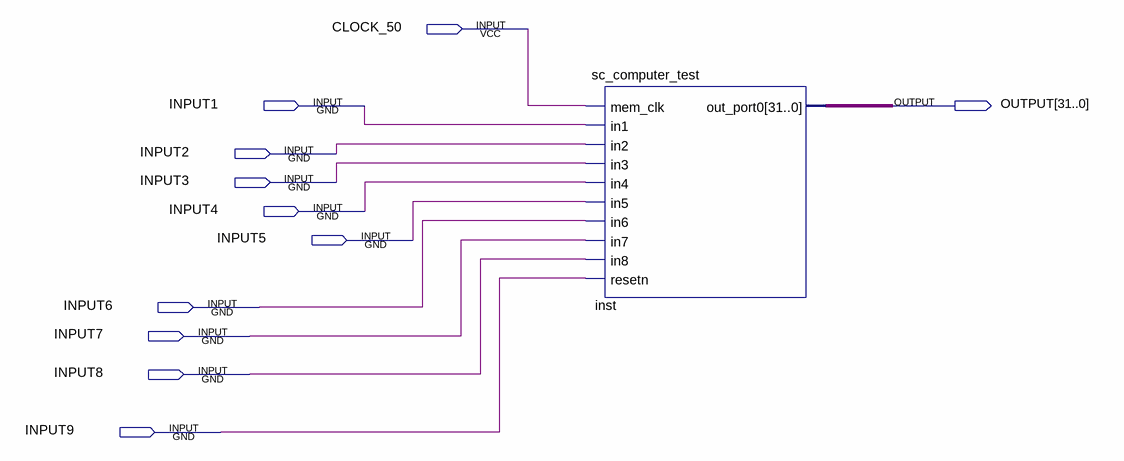
[diagram p0: schematic sheet]
// Quartus schematic sc_computer_version.bdf as structural Verilog: 1 symbols, 11 pins
module sc_computer_version (
  input  CLOCK_50,
  input  INPUT1,
  input  INPUT2,
  input  INPUT3,
  input  INPUT4,
  input  INPUT5,
  input  INPUT6,
  input  INPUT7,
  input  INPUT8,
  input  INPUT9,
  output [31:0] OUTPUT
);

  sc_computer_test inst (
    .mem_clk(CLOCK_50), .in1(INPUT1), .in2(INPUT2), .in3(INPUT3), .in4(INPUT4), .in5(INPUT5), .in6(INPUT6),
    .in7(INPUT7), .in8(INPUT8), .resetn(INPUT9), .out_port0(OUTPUT));
endmodule
